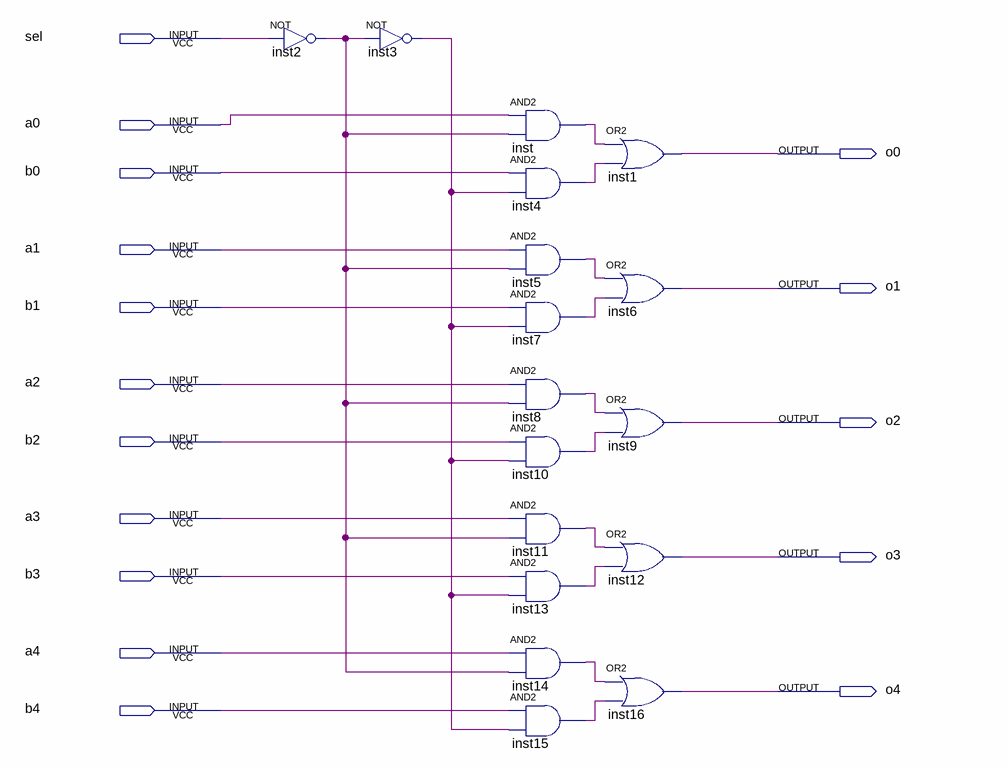
[diagram p0: schematic sheet]
// Quartus schematic MUX_10t5.bdf as structural Verilog: 17 symbols, 16 pins
module MUX_10t5 (
  input  sel,
  input  a0,
  input  b0,
  input  a1,
  input  b1,
  input  a2,
  input  b2,
  input  a3,
  input  b3,
  input  a4,
  input  b4,
  output o0,
  output o1,
  output o2,
  output o3,
  output o4
);

  wire inst2_out, inst3_out, inst4_out, inst5_out, inst7_out, inst8_out, inst10_out, inst11_out, inst13_out,
       inst14_out, inst15_out, inst_out;

  not inst2 (inst2_out, sel);
  not inst3 (inst3_out, inst2_out);
  and inst (inst_out, a0, inst2_out);
  and inst4 (inst4_out, b0, inst3_out);
  and inst5 (inst5_out, a1, inst2_out);
  and inst7 (inst7_out, b1, inst3_out);
  and inst8 (inst8_out, a2, inst2_out);
  and inst10 (inst10_out, b2, inst3_out);
  and inst11 (inst11_out, a3, inst2_out);
  and inst13 (inst13_out, b3, inst3_out);
  and inst14 (inst14_out, a4, inst2_out);
  and inst15 (inst15_out, b4, inst3_out);
  or inst1 (o0, inst_out, inst4_out);
  or inst6 (o1, inst5_out, inst7_out);
  or inst9 (o2, inst8_out, inst10_out);
  or inst12 (o3, inst11_out, inst13_out);
  or inst16 (o4, inst14_out, inst15_out);
endmodule
